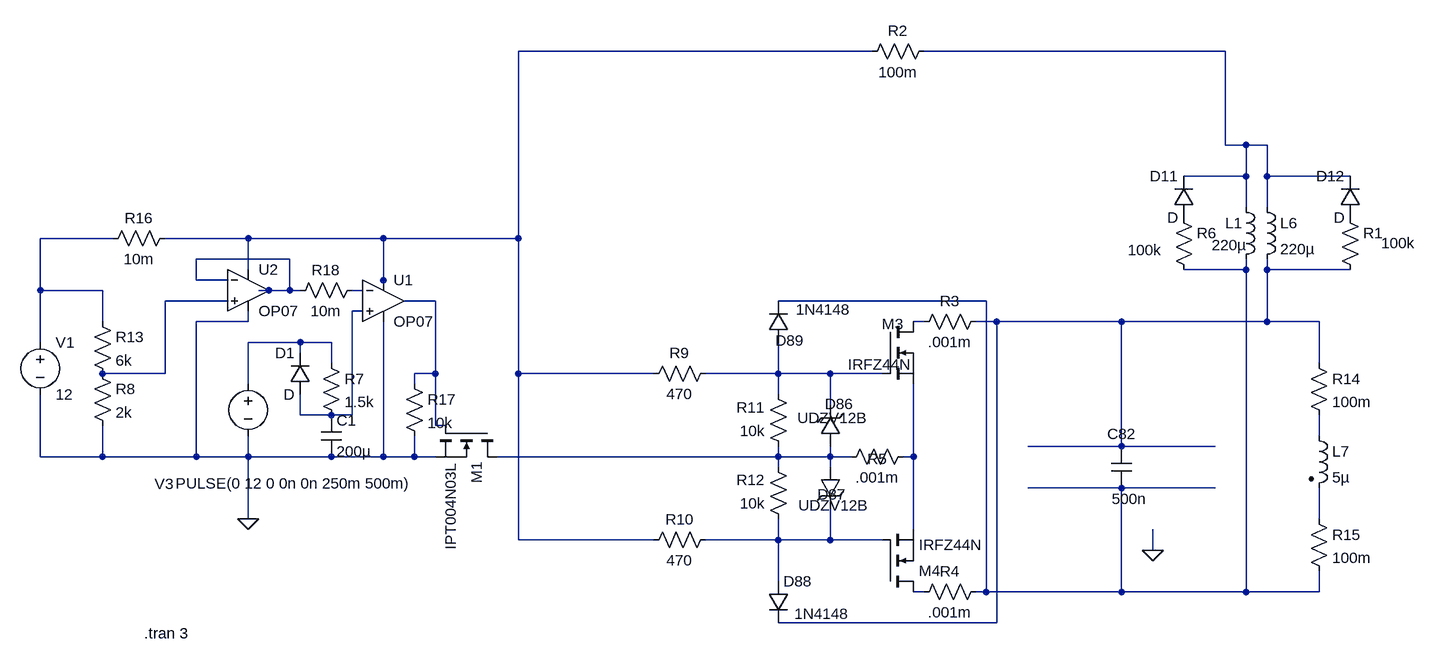
[diagram p0: schematic working zvs driver CW flyback protection.asc]
working zvs driver CW flyback protection.asc, the LTspice schematic file:
Version 4.1
SHEET 1 8356 2520
WIRE 64 400 -480 400
WIRE 608 400 144 400
WIRE 608 544 608 400
WIRE 640 544 608 544
WIRE 672 544 640 544
WIRE 640 592 640 544
WIRE 640 592 544 592
WIRE 672 592 672 544
WIRE 800 592 672 592
WIRE 640 640 640 592
WIRE 672 640 672 592
WIRE -1104 688 -1216 688
WIRE -896 688 -1024 688
WIRE -688 688 -896 688
WIRE -480 688 -480 400
WIRE -480 688 -688 688
WIRE -832 720 -976 720
WIRE -896 736 -896 688
WIRE 640 736 640 720
WIRE 640 736 544 736
WIRE 672 736 672 720
WIRE 800 736 672 736
WIRE -976 752 -976 720
WIRE -928 752 -976 752
WIRE -688 752 -688 688
WIRE -1216 768 -1216 688
WIRE -1120 768 -1216 768
WIRE -864 768 -880 768
WIRE -832 768 -832 720
WIRE -832 768 -864 768
WIRE -816 768 -832 768
WIRE -720 768 -736 768
WIRE -688 768 -688 752
WIRE -928 784 -1024 784
WIRE -608 784 -656 784
WIRE 240 784 -80 784
WIRE -720 800 -736 800
WIRE -1120 816 -1120 768
WIRE -896 816 -896 800
WIRE -896 816 -976 816
WIRE 144 816 128 816
WIRE 256 816 224 816
WIRE 448 816 256 816
WIRE 672 816 672 736
WIRE 672 816 448 816
WIRE 752 816 672 816
WIRE -1216 848 -1216 768
WIRE -816 848 -896 848
WIRE -768 848 -816 848
WIRE -816 864 -816 848
WIRE -768 880 -768 848
WIRE 752 880 752 816
WIRE -1024 896 -1024 784
WIRE -1024 896 -1120 896
WIRE -608 896 -608 784
WIRE -608 896 -640 896
WIRE -480 896 -480 688
WIRE -272 896 -480 896
WIRE -80 896 -80 848
WIRE -80 896 -192 896
WIRE 0 896 -80 896
WIRE 80 896 0 896
WIRE -896 912 -896 848
WIRE -640 912 -640 896
WIRE -80 928 -80 896
WIRE 0 944 0 896
WIRE -816 960 -816 928
WIRE -768 960 -816 960
WIRE -736 960 -736 800
WIRE -736 960 -768 960
WIRE -608 976 -608 896
WIRE -592 976 -608 976
WIRE 752 992 752 960
WIRE 448 1008 448 816
WIRE 448 1008 304 1008
WIRE 592 1008 448 1008
WIRE -1216 1024 -1216 928
WIRE -1120 1024 -1120 976
WIRE -1120 1024 -1216 1024
WIRE -976 1024 -976 816
WIRE -976 1024 -1120 1024
WIRE -896 1024 -896 992
WIRE -896 1024 -976 1024
WIRE -768 1024 -896 1024
WIRE -688 1024 -688 816
WIRE -688 1024 -768 1024
WIRE -640 1024 -640 992
WIRE -640 1024 -688 1024
WIRE -608 1024 -640 1024
WIRE -80 1024 -80 1008
WIRE -80 1024 -512 1024
WIRE 0 1024 0 1008
WIRE 0 1024 -80 1024
WIRE 32 1024 0 1024
WIRE 128 1024 128 912
WIRE 128 1024 112 1024
WIRE -80 1040 -80 1024
WIRE 0 1040 0 1024
WIRE 448 1072 304 1072
WIRE 592 1072 448 1072
WIRE -896 1120 -896 1024
WIRE 752 1120 752 1072
WIRE 128 1136 128 1024
WIRE -480 1152 -480 896
WIRE -272 1152 -480 1152
WIRE -80 1152 -80 1120
WIRE -80 1152 -192 1152
WIRE 0 1152 0 1104
WIRE 0 1152 -80 1152
WIRE 80 1152 0 1152
WIRE 496 1168 496 1136
WIRE -80 1216 -80 1152
WIRE 144 1232 128 1232
WIRE 240 1232 240 784
WIRE 240 1232 224 1232
WIRE 448 1232 448 1072
WIRE 448 1232 240 1232
WIRE 640 1232 640 736
WIRE 640 1232 448 1232
WIRE 752 1232 752 1200
WIRE 752 1232 640 1232
WIRE 256 1280 256 816
WIRE 256 1280 -80 1280
FLAG 496 1168 0
FLAG -896 1120 0
SYMBOL voltage -896 896 R0
WINDOW 123 0 0 Left 0
WINDOW 39 0 0 Left 0
WINDOW 0 -144 170 Left 2
WINDOW 3 -112 169 Left 2
SYMATTR InstName V3
SYMATTR Value PULSE(0 12 0 0n 0n 250m 500m)
SYMBOL res -176 880 R90
WINDOW 0 0 56 VBottom 2
WINDOW 3 32 56 VTop 2
SYMATTR InstName R9
SYMATTR Value 470
SYMBOL res -176 1136 R90
WINDOW 0 0 56 VBottom 2
WINDOW 3 32 56 VTop 2
SYMATTR InstName R10
SYMATTR Value 470
SYMBOL res -64 1024 R180
WINDOW 0 36 76 Left 2
WINDOW 3 36 40 Left 2
SYMATTR InstName R11
SYMATTR Value 10k
SYMBOL res -64 1136 R180
WINDOW 0 36 76 Left 2
WINDOW 3 36 40 Left 2
SYMATTR InstName R12
SYMATTR Value 10k
SYMBOL zener 16 1008 R180
WINDOW 0 -20 65 Left 2
WINDOW 3 -41 44 Left 2
SYMATTR InstName D86
SYMATTR Value UDZV12B
SYMBOL zener -16 1040 R0
WINDOW 0 -4 42 Left 2
WINDOW 3 -33 59 Left 2
SYMATTR InstName D87
SYMATTR Value UDZV12B
SYMBOL diode -96 1216 R0
WINDOW 3 41 50 Left 2
SYMATTR Value 1N4148
SYMATTR InstName D88
SYMBOL diode -64 848 R180
WINDOW 0 -24 3 Left 2
WINDOW 3 -96 51 Left 2
SYMATTR InstName D89
SYMATTR Value 1N4148
SYMBOL nmos 80 816 R0
WINDOW 0 -1 4 Left 2
WINDOW 3 -53 66 Left 2
SYMATTR InstName M3
SYMATTR Value IRFZ44N
SYMBOL cap 432 1008 R0
WINDOW 0 -6 -19 Left 2
WINDOW 3 1 81 Left 2
SYMATTR InstName C82
SYMATTR Value 500n
SYMBOL ind 656 624 R0
SYMATTR InstName L6
SYMATTR Value 220µ
SYMBOL ind2 736 976 R0
SYMATTR InstName L7
SYMATTR Value 5µ
SYMATTR Type ind
SYMBOL nmos 80 1232 M180
SYMATTR InstName M4
SYMATTR Value IRFZ44N
SYMBOL res 736 864 R0
SYMATTR InstName R14
SYMATTR Value 100m
SYMBOL res 736 1104 R0
SYMATTR InstName R15
SYMATTR Value 100m
SYMBOL res 160 384 R90
WINDOW 0 0 56 VBottom 2
WINDOW 3 32 56 VTop 2
SYMATTR InstName R2
SYMATTR Value 100m
SYMBOL res 240 800 R90
WINDOW 0 0 56 VBottom 2
WINDOW 3 32 56 VTop 2
SYMATTR InstName R3
SYMATTR Value .001m
SYMBOL res 240 1216 R90
WINDOW 0 0 56 VBottom 2
WINDOW 3 32 56 VTop 2
SYMATTR InstName R4
SYMATTR Value .001m
SYMBOL res 128 1008 R90
WINDOW 0 35 56 VBottom 2
WINDOW 3 32 56 VTop 2
SYMATTR InstName R5
SYMATTR Value .001m
SYMBOL ind 624 624 R0
WINDOW 0 -16 40 Left 2
WINDOW 3 -37 74 Left 2
SYMATTR InstName L1
SYMATTR Value 220µ
SYMBOL diode 560 656 R180
WINDOW 0 24 64 Left 2
WINDOW 3 24 0 Left 2
SYMATTR InstName D11
SYMBOL diode 816 656 R180
WINDOW 0 24 64 Left 2
WINDOW 3 24 0 Left 2
SYMATTR InstName D12
SYMBOL res 784 640 R0
WINDOW 3 64 55 Left 2
SYMATTR Value 100k
SYMATTR InstName R1
SYMBOL res 528 640 R0
WINDOW 3 -70 66 Left 2
SYMATTR Value 100k
SYMATTR InstName R6
SYMBOL OpAmps\\OP07 -688 720 R0
SYMATTR InstName U1
SYMBOL cap -784 960 R0
SYMATTR InstName C1
SYMATTR Value 200µ
SYMBOL res -784 864 R0
SYMATTR InstName R7
SYMATTR Value 1.5k
SYMBOL diode -800 928 R180
WINDOW 0 24 64 Left 2
WINDOW 3 24 0 Left 2
SYMATTR InstName D1
SYMBOL res -1136 880 R0
SYMATTR InstName R8
SYMATTR Value 2k
SYMBOL res -1136 800 R0
SYMATTR InstName R13
SYMATTR Value 6k
SYMBOL voltage -1216 832 R0
WINDOW 123 0 0 Left 0
WINDOW 39 0 0 Left 0
SYMATTR InstName V1
SYMATTR Value 12
SYMBOL OpAmps\\OP07 -896 704 R0
SYMATTR InstName U2
SYMBOL nmos -512 976 R90
SYMATTR InstName M1
SYMATTR Value IPT004N03L
SYMBOL res -1008 672 R90
WINDOW 0 0 56 VBottom 2
WINDOW 3 32 56 VTop 2
SYMATTR InstName R16
SYMATTR Value 10m
SYMBOL res -720 752 R90
WINDOW 0 0 56 VBottom 2
WINDOW 3 32 56 VTop 2
SYMATTR InstName R18
SYMATTR Value 10m
SYMBOL res -656 896 R0
SYMATTR InstName R17
SYMATTR Value 10k
TEXT -1056 1296 Left 2 !.tran 3

The netlist it stands for:
* working zvs driver CW flyback protection.asc
V3 N012 0 PULSE(0 12 0 0n 0n 250m 500m)
R9 N013 N001 470
R10 N018 N001 470
R11 N015 N013 10k
R12 N018 N015 10k
D86 N015 N013 UDZV12B
D87 N015 N018 UDZV12B
D88 N018 N006 1N4148
D89 N013 N005 1N4148
M3 N011 N013 N016 N016 IRFZ44N
C82 N006 N005 500n
L6 N002 N006 220µ
L7 N014 N017 5µ
M4 N019 N018 N016 N016 IRFZ44N
R14 N006 N014 100m
R15 N017 N005 100m
R2 N002 N001 100m
R3 N006 N011 .001m
R4 N005 N019 .001m
R5 N016 N015 .001m
L1 N002 N005 220µ
D11 P001 N002 D
D12 P002 N002 D
R1 P002 N006 100k
R6 P001 N005 100k
X§U1 N010 N007 N001 0 N009 LT1001  ; OP07, pins In+ In- V+ V- OUT
C1 N010 0 200µ
R7 N012 N010 1.5k
D1 N010 N012 D
R8 N008 0 2k
R13 N003 N008 6k
V1 N003 0 12
X§U2 N008 N004 N001 0 N004 LT1001  ; OP07, pins In+ In- V+ V- OUT
M1 N015 N009 0 0 IPT004N03L
R16 N001 N003 10m
R18 N007 N004 10m
R17 N009 0 10k
.model D D
.lib standard.dio
.model NMOS NMOS
.model PMOS PMOS
.lib standard.mos
.tran 3
.lib LTC.lib
.backanno
.end